# Altium project NODEMCU_ESP12.PrjPCB
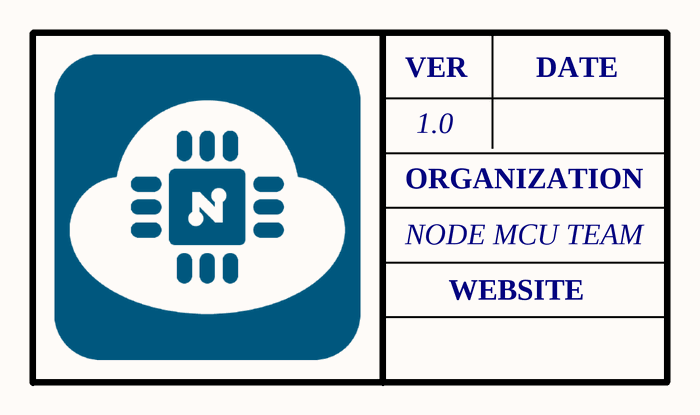
[diagram p0: 01_SYSTEM.SchDoc]
7 sheets, 34 parts. Net scope: flat (ports and power ports of the same name join across sheets).
Board file: NODEMCU_ESP12.PcbDoc
Sheets:
  01_SYSTEM.SchDoc
  02_ESP12_CORE.SchDoc
  03_USB_TO_UART.SchDoc
  04_POWER.SchDoc
  05_IO_CONN.SchDoc
  06_KEY.SchDoc
  07_ADC.SchDoc

## Sheet 01_SYSTEM.SchDoc: NODE MCU DEVKIT V1.0
size A4; Date: 25/01/2015; Author: HuangRui <vowstar@gmail.com>; DrawnBy: JiYaping <jyp1817@gmail.com>; Organization: WWW.NODEMCU.COM

### Notes on the sheet
- VER
- 1.0
- DATE
- ORGANIZATION
- NODE MCU TEAM
- WEBSITE

## Sheet 02_ESP12_CORE.SchDoc: ESP-12 CORE
size A4; Date: 20/11/2014; Author: HuangRui <vowstar@gmail.com>; DrawnBy: JiYaping <jyp1817@gmail.com>; Organization: WWW.NODEMCU.COM
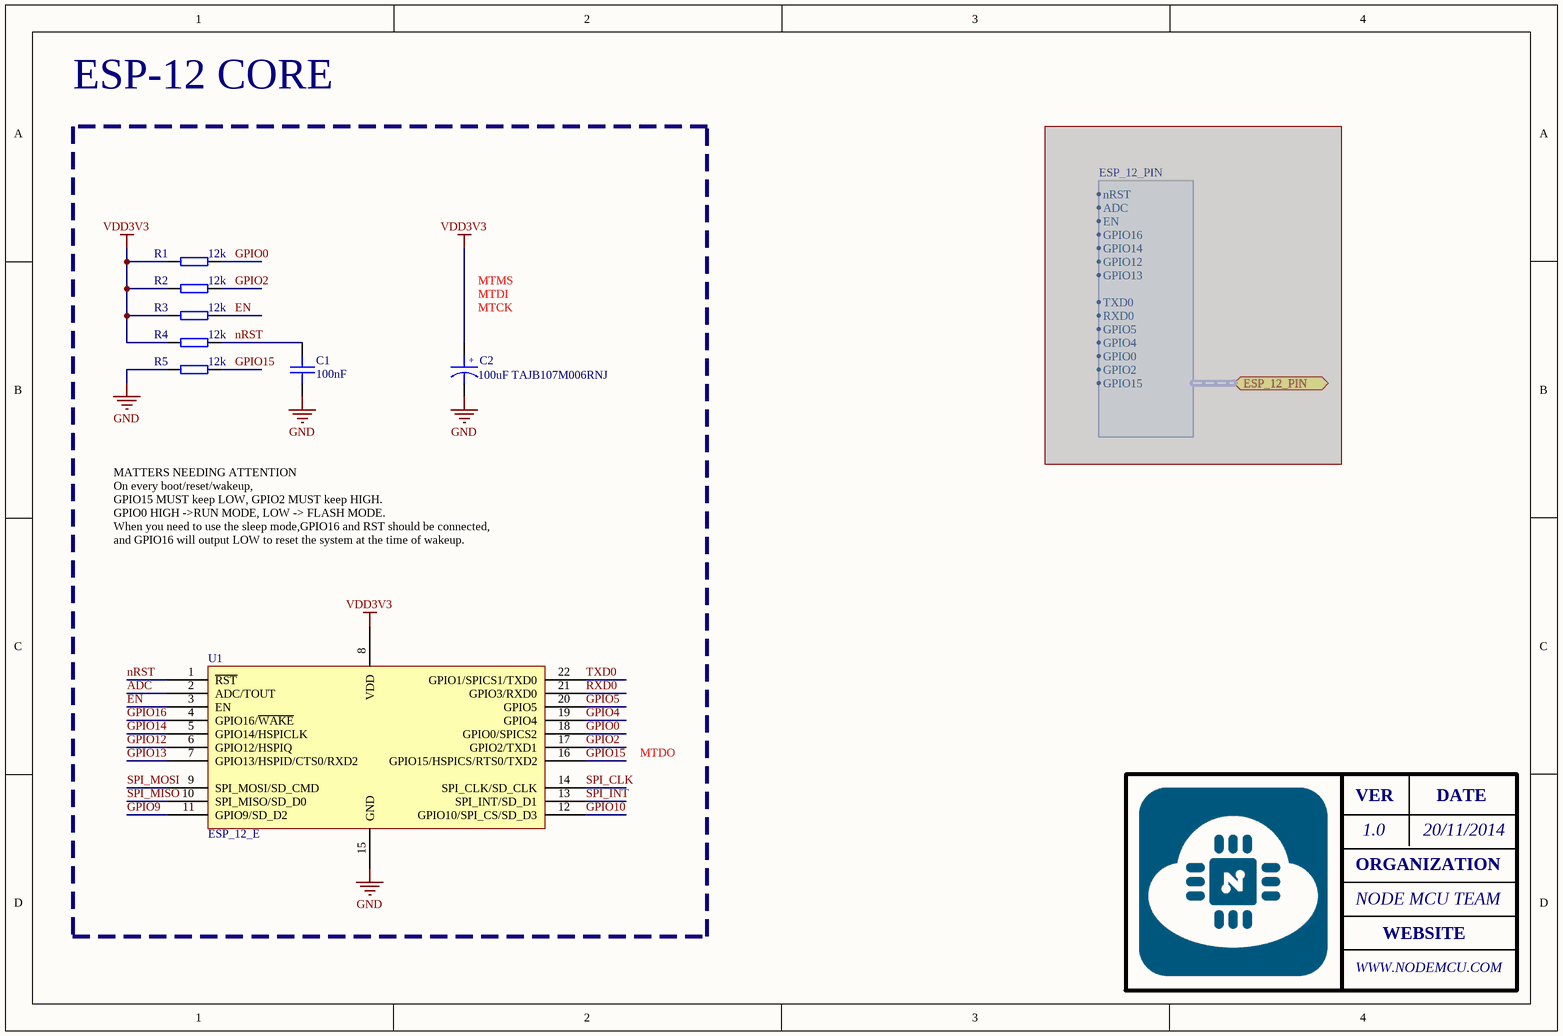
[diagram p1: 02_ESP12_CORE.SchDoc]

### Parts
C1  100nF  [SMT_C_0402]
C2  100uF TAJB107M006RNJ  [SMT_C_Tantalum_B]
R1  12k  [SMT_R_0402]
R2  12k  [SMT_R_0402]
R3  12k  [SMT_R_0402]
R4  12k  [SMT_R_0402]
R5  12k  [SMT_R_0402]
U1  ESP_12_E  [ESP_12_E_L]

### Ports
ESP_12_PIN (harness ESP_12_PIN)

### Harnesses
ESP_12_PIN: nRST, ADC, EN, GPIO16, GPIO12, GPIO13, GPIO14, TXD0, RXD0, GPIO4, GPIO5, GPIO0, GPIO2, GPIO15

### Nets
GND: C1.2 C2.2 R5.1 U1.15(GND)
VDD3V3: C2.1 R1.1 R2.1 R3.1 R4.1 U1.8(VDD)
ADC: U1.2(ADC/TOUT)
EN: R3.2 U1.3(EN)
GPIO0: R1.2 U1.18(GPIO0/SPICS2)
GPIO2: R2.2 U1.17(GPIO2/TXD1)
GPIO4: U1.19(GPIO4)
GPIO5: U1.20(GPIO5)
GPIO9: U1.11(GPIO9/SD_D2)
GPIO10: U1.12(GPIO10/SPI_CS/SD_D3)
GPIO12: U1.6(GPIO12/HSPIQ)
GPIO13: U1.7(GPIO13/HSPID/CTS0/RXD2)
GPIO14: U1.5(GPIO14/HSPICLK)
GPIO15: R5.2 U1.16(GPIO15/HSPICS/RTS0/TXD2)
GPIO16: U1.4(GPIO16/~{WAKE})
nRST: C1.1 R4.2 U1.1(~{RST})
RXD0: U1.21(GPIO3/RXD0)
SPI_CLK: U1.14(SPI_CLK/SD_CLK)
SPI_INT: U1.13(SPI_INT/SD_D1)
SPI_MISO: U1.10(SPI_MISO/SD_D0)
SPI_MOSI: U1.9(SPI_MOSI/SD_CMD)
TXD0: U1.22(GPIO1/SPICS1/TXD0)

### Notes on the sheet
- (near C2) MTCK
- MTDI
- MTMS
- MATTERS NEEDING ATTENTION
  On every boot/reset/wakeup,
  GPIO15 MUST keep LOW, GPIO2 MUST keep HIGH.
  GPIO0 HIGH ->RUN MODE, LOW -> FLASH MODE.
  When you need to use the sleep mode,GPIO16 and RST should be connected,
  and GPIO16 will output LOW to reset the system at the time of wakeup.
- MTDO
- VER
- 1.0
- DATE
- ORGANIZATION
- NODE MCU TEAM
- WEBSITE
- (in symbol SMT_C_Tantalum_B) +

### Library data of the parts
C1 = SMT_C_0402: Surface mount capacitor 0402
C2 = SMT_C_Tantalum_B: Capacitor, SM Tantalum; Body 3.5 x 2.8 mm (LxW typ)
R1-R5 = SMT_R_0402: Surface mount resistor 0402
U1 = ESP_12_E: ESP-12 Wi-Fi Module by AI-Thinker; IC: ESP8266-EX; Vendor: Ai-thinker

## Sheet 03_USB_TO_UART.SchDoc: USB TO UART
size A4; Date: 20/11/2014; Author: HuangRui <vowstar@gmail.com>; DrawnBy: JiYaping <jyp1817@gmail.com>; Organization: WWW.NODEMCU.COM
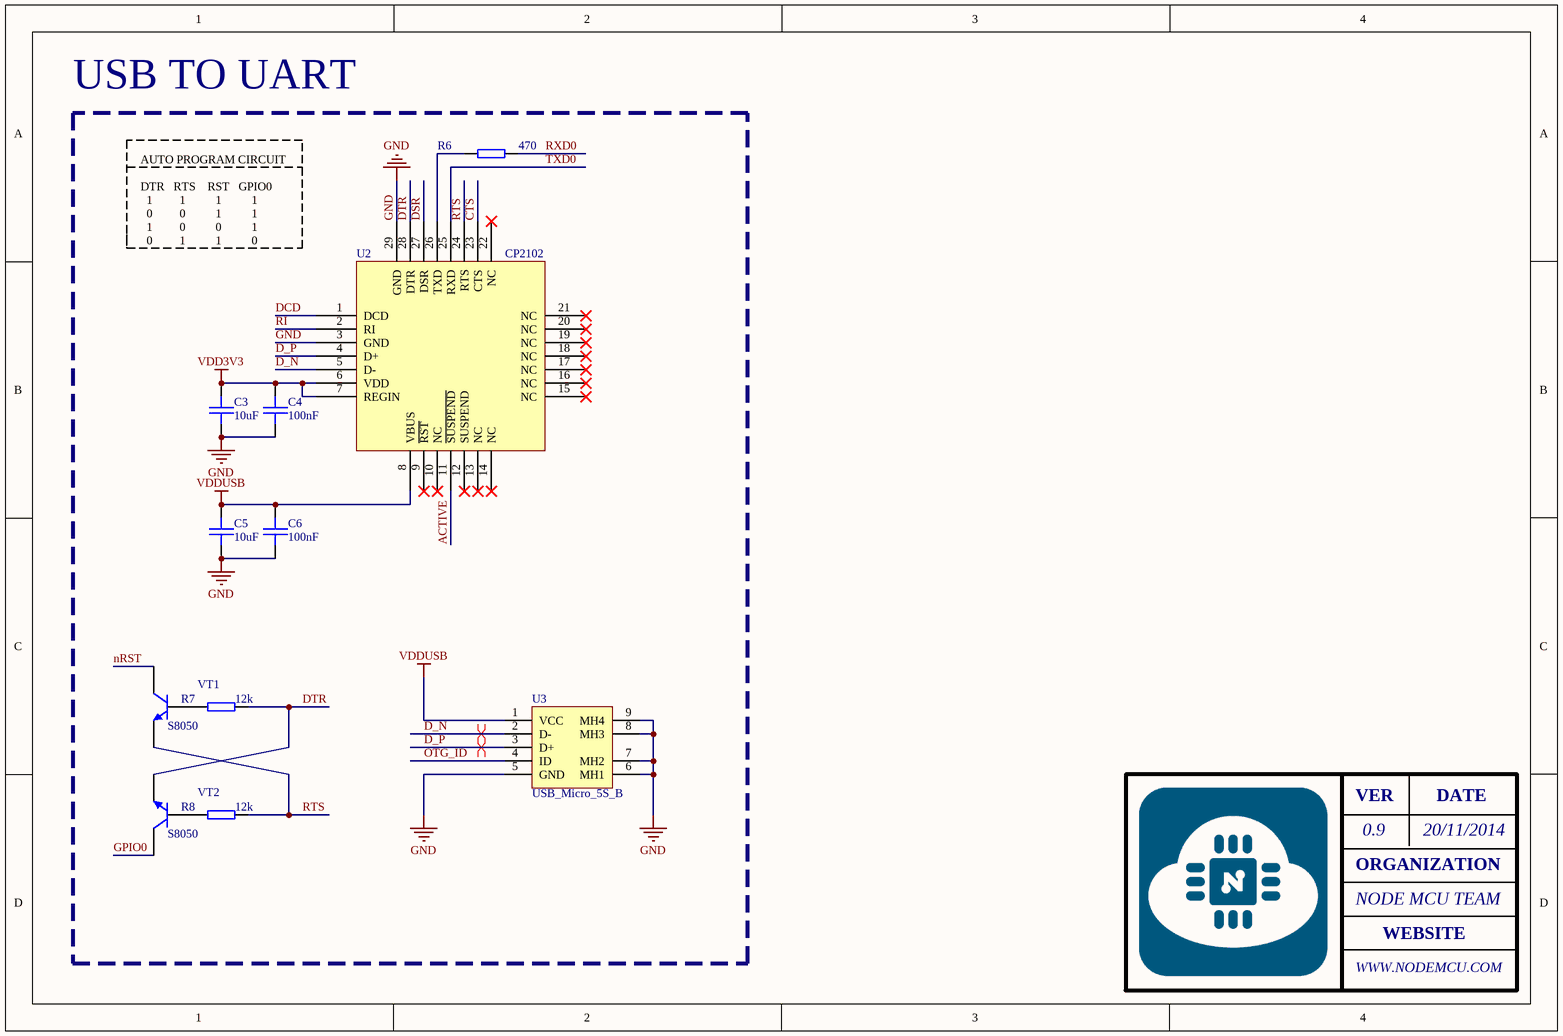
[diagram p2: 03_USB_TO_UART.SchDoc]

### Parts
C3  10uF  [SMT_C_0402]
C4  100nF  [SMT_C_0402]
C5  10uF  [SMT_C_0402]
C6  100nF  [SMT_C_0402]
R6  470  [SMT_R_0402]
R7  12k  [SMT_R_0402]
R8  12k  [SMT_R_0402]
U2  CP2102  [CP2102]
U3  USB_Micro_5S_B  [USB_MICRO_5S_B]
VT1  S8050  [SMT_TRIODE_NPN]
VT2  S8050  [SMT_TRIODE_NPN]

### Nets
GND: C3.2 C4.2 C5.2 C6.2 U2.3(GND) U2.29(GND) U3.5(GND) U3.6(MH1) U3.7(MH2) U3.8(MH3) U3.9(MH4)
VDD3V3: C3.1 C4.1 U2.6(VDD) U2.7(REGIN)
VDDUSB: C5.1 C6.1 U2.8(VBUS) U3.1(VCC)
ACTIVE: U2.11(~{SUSPEND})
CTS: U2.23(CTS)
D_N: U2.5(D-) U3.2(D-)
D_P: U2.4(D+) U3.3(D+)
DCD: U2.1(DCD)
DSR: U2.27(DSR)
DTR: R7.2 U2.28(DTR) VT2.2(E)
GPIO0: VT2.3(C)
nRST: VT1.3(C)
OTG_ID: U3.4(ID)
RI: U2.2(RI)
RTS: R8.2 U2.24(RTS) VT1.2(E)
RXD0: R6.2
TXD0: U2.25(RXD)
NetR6_1: R6.1 U2.26(TXD)
NetR7_1: R7.1 VT1.1(B)
NetR8_1: R8.1 VT2.1(B)

Not connected (* = marked no-connect by the designer): U2 9(~{RST})* 10(NC)* 12(SUSPEND)* 13(NC)* 14(NC)* 15(NC)* 16(NC)* 17(NC)* 18(NC)* 19(NC)* 20(NC)* 21(NC)* 22(NC)*

### Layout directives
differential pair: D_N, D_P

### Notes on the sheet
- AUTO PROGRAM CIRCUIT
  DTR   RTS    RST   GPIO0
  1         1          1          1
  0         0          1          1
  1         0          0          1
  0         1          1          0
- VER
- 0.9
- DATE
- ORGANIZATION
- NODE MCU TEAM
- WEBSITE

### Library data of the parts
C3-C6 = SMT_C_0402: Surface mount capacitor 0402
R6-R8 = SMT_R_0402: Surface mount resistor 0402
U3 = USB_Micro_5S_B: USB micro female SMT with 4 fixed foot
VT1 VT2 = SMT_TRIODE_NPN: Surface mount NPN transistor, package SOT-23

## Sheet 04_POWER.SchDoc: POWER
size A4; Date: 28/01/2015; Author: HuangRui <vowstar@gmail.com>; DrawnBy: JiYaping <jyp1817@gmail.com>; Organization: WWW.NODEMCU.COM
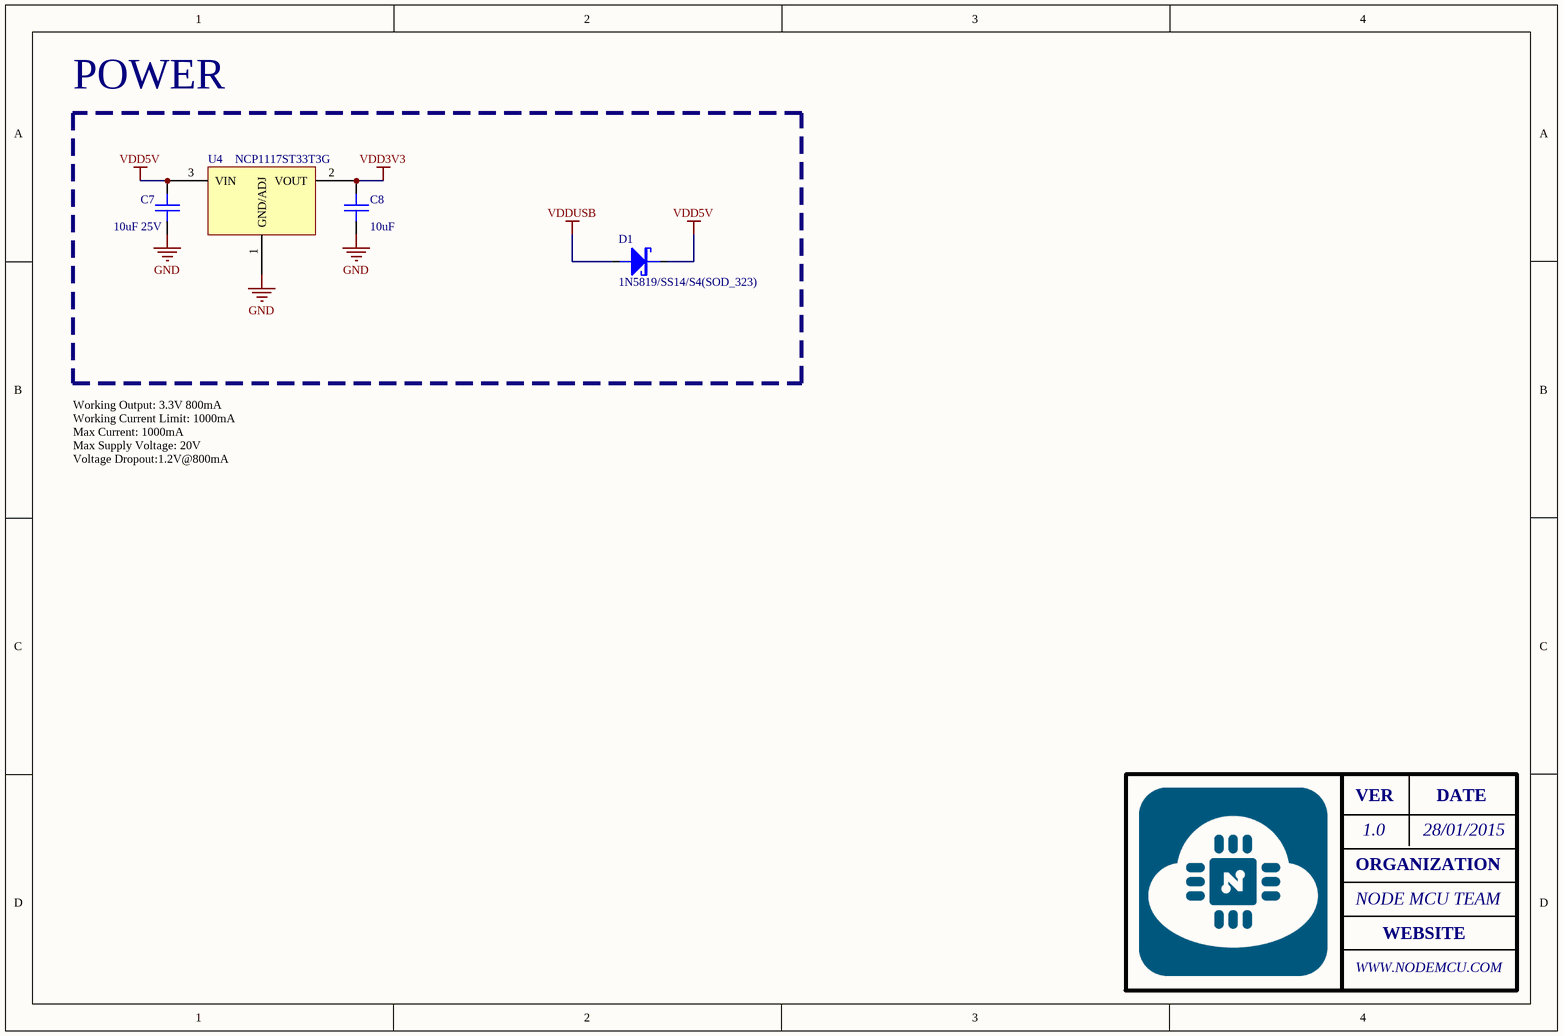
[diagram p3: 04_POWER.SchDoc]

### Parts
C7  10uF 25V  [SMT_C_0805]
C8  10uF  [SMT_C_0402]
D1  1N5819/SS14/S4(SOD_323)  [SMT_DIODE_SOD_323]
U4  NCP1117ST33T3G  [SOT-223]

### Nets
GND: C7.2 C8.2 U4.1(GND/ADJ)
VDD3V3: C8.1 U4.2(VOUT)
VDD5V: C7.1 D1.2(K) U4.3(VIN)
VDDUSB: D1.1(A)

### Notes on the sheet
- Working Output: 3.3V 800mA
  Working Current Limit: 1000mA
  Max Current: 1000mA
  Max Supply Voltage: 20V
  Voltage Dropout:1.2V@800mA
- VER
- 1.0
- DATE
- ORGANIZATION
- NODE MCU TEAM
- WEBSITE

### Library data of the parts
C7 = SMT_C_0805: Surface mount capacitor 0805
C8 = SMT_C_0402: Surface mount capacitor 0402
D1 = SMT_DIODE_SCHOTTKY_SOD_323: Surface mount schottky diode SOD-323(0805) Package
U4 = NCP1117: NCP1117, NCV1117. 1.0 A Low-Dropout Positive  Fixed and Adjustable  Voltage Regulators

## Sheet 05_IO_CONN.SchDoc: IO CONN
size A4; Date: 20/11/2014; Author: HuangRui <vowstar@gmail.com>; DrawnBy: JiYaping <jyp1817@gmail.com>; Organization: WWW.NODEMCU.COM
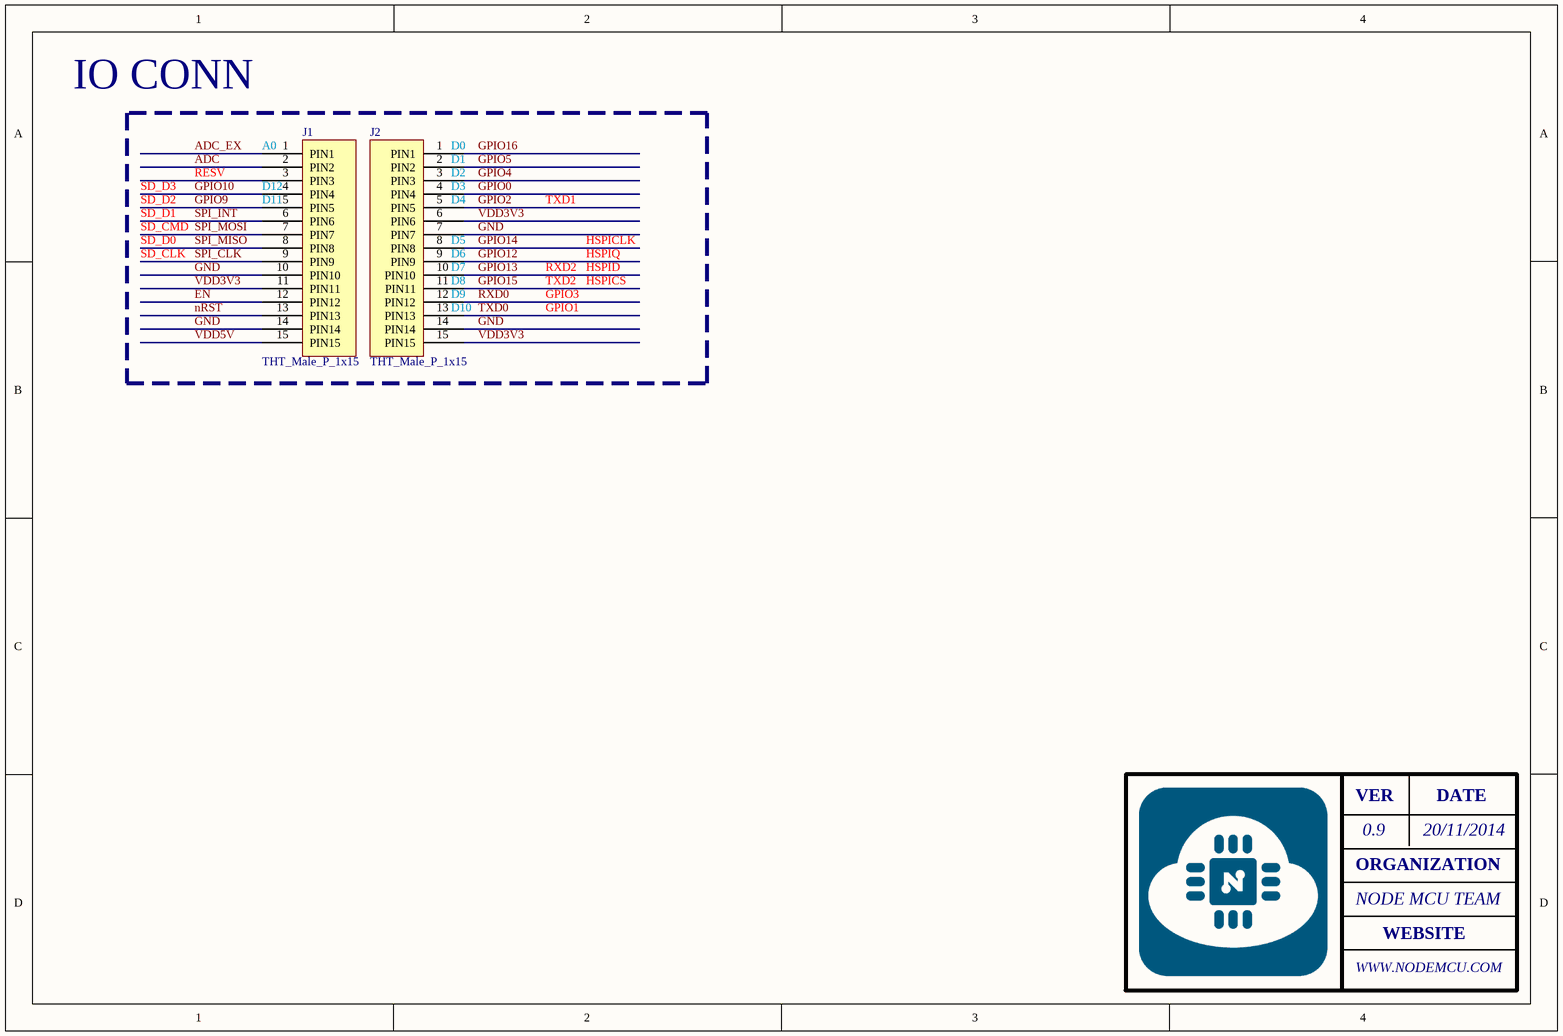
[diagram p4: 05_IO_CONN.SchDoc]

### Parts
J1  THT_Male_P_1x15  [THT_Male_P_1x15-2.54mm]
J2  THT_Male_P_1x15  [THT_Male_P_1x15-2.54mm]

### Nets
ADC: J1.2(PIN2)
ADC_EX: J1.1(PIN1)
EN: J1.12(PIN12)
GND: J1.10(PIN10) J1.14(PIN14) J2.7(PIN7) J2.14(PIN14)
GPIO0: J2.4(PIN4)
GPIO2: J2.5(PIN5)
GPIO4: J2.3(PIN3)
GPIO5: J2.2(PIN2)
GPIO9: J1.5(PIN5)
GPIO10: J1.4(PIN4)
GPIO12: J2.9(PIN9)
GPIO13: J2.10(PIN10)
GPIO14: J2.8(PIN8)
GPIO15: J2.11(PIN11)
GPIO16: J2.1(PIN1)
nRST: J1.13(PIN13)
RXD0: J2.12(PIN12)
SPI_CLK: J1.9(PIN9)
SPI_INT: J1.6(PIN6)
SPI_MISO: J1.8(PIN8)
SPI_MOSI: J1.7(PIN7)
TXD0: J2.13(PIN13)
VDD3V3: J1.11(PIN11) J2.6(PIN6) J2.15(PIN15)
VDD5V: J1.15(PIN15)

Not connected (* = marked no-connect by the designer): J1 3(PIN3)

### Notes on the sheet
- RESV
- (near J1) A0
- (near J2) D0
- (near J2) D1
- (near J2) D2
- SD_D0
- SD_CMD
- SD_D1
- SD_D3
- SD_D2
- (near J1) D12
- (near J1) D11
- (near J2) D3
- (near J2) D4
- (near J2) D5
- TXD1
- HSPICLK
- SD_CLK
- (near J2) D6
- (near J2) D7
- (near J2) D8
- (near J2) D9
- (near J2) D10
- TXD2
- RXD2
- GPIO3
- GPIO1
- HSPIQ
- HSPID
- HSPICS
- VER
- 0.9
- DATE
- ORGANIZATION
- NODE MCU TEAM
- WEBSITE

### Library data of the parts
J1 J2 = THT_Male_P_1x15: THT Male pin header strip 1x15

## Sheet 06_KEY.SchDoc: KEY
size A4; Date: 20/11/2014; Author: HuangRui <vowstar@gmail.com>; DrawnBy: JiYaping <jyp1817@gmail.com>; Organization: WWW.NODEMCU.COM
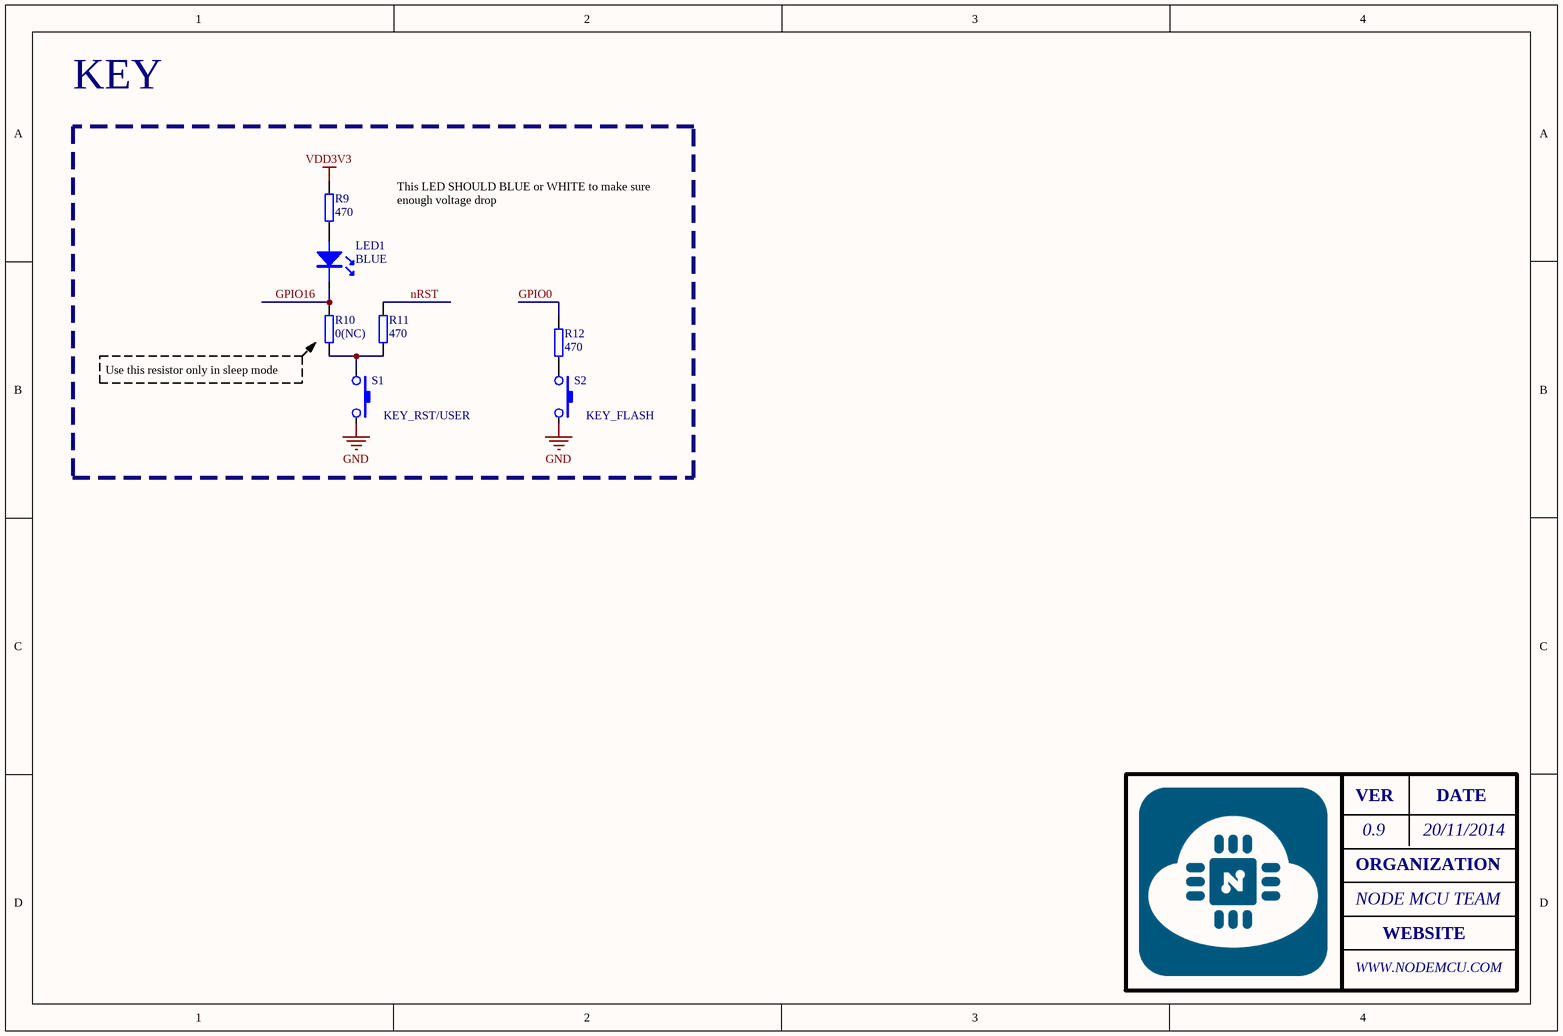
[diagram p5: 06_KEY.SchDoc]

### Parts
LED1  BLUE  [SMT_LED_0603]
R9  470  [SMT_R_0402]
R10  0(NC)  [SMT_R_0402]
R11  470  [SMT_R_0402]
R12  470  [SMT_R_0402]
S1  KEY_RST/USER  [SMT_SW_PTS_820]
S2  KEY_FLASH  [SMT_SW_PTS_820]

### Nets
GND: S1.2 S2.2
VDD3V3: R9.2
GPIO0: R12.2
GPIO16: LED1.2(K) R10.2
nRST: R11.2
NetLED1_1: LED1.1(A) R9.1
NetR10_1: R10.1 R11.1 S1.1
NetR12_1: R12.1 S2.1

### Notes on the sheet
- This LED SHOULD BLUE or WHITE to make sure enough voltage drop
- Use this resistor only in sleep mode
- VER
- 0.9
- DATE
- ORGANIZATION
- NODE MCU TEAM
- WEBSITE

### Library data of the parts
LED1 = SMT_LED_0603: SMT LED
R9-R12 = SMT_R_0402: Surface mount resistor 0402
S1 S2 = SMT_SW_PTS_820: SMT Tactile ‎Switch PTS 820 Series

## Sheet 07_ADC.SchDoc: ADC
size A4; Date: 20/11/2014; Author: HuangRui <vowstar@gmail.com>; DrawnBy: JiYaping <jyp1817@gmail.com>; Organization: WWW.NODEMCU.COM
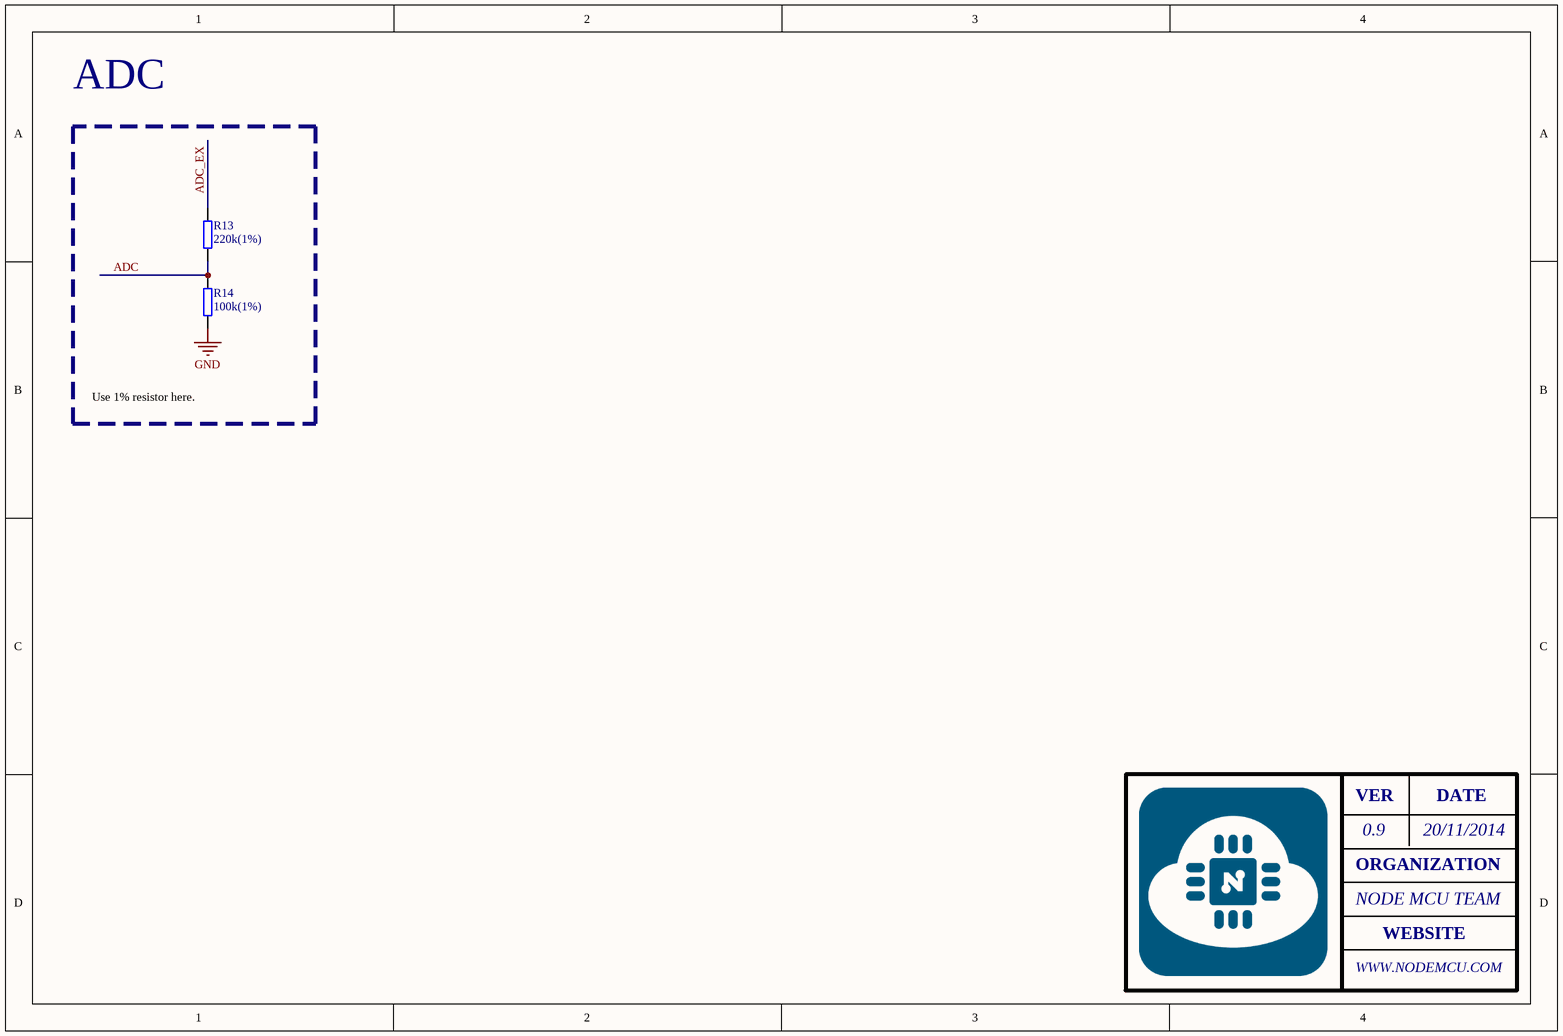
[diagram p6: 07_ADC.SchDoc]

### Parts
R13  220k(1%)  [SMT_R_0402]
R14  100k(1%)  [SMT_R_0402]

### Nets
GND: R14.1
ADC: R13.1 R14.2
ADC_EX: R13.2

### Notes on the sheet
- Use 1% resistor here.
- VER
- 0.9
- DATE
- ORGANIZATION
- NODE MCU TEAM
- WEBSITE

### Library data of the parts
R13 R14 = SMT_R_0402: Surface mount resistor 0402

## Nets that join several sheets
GND: 02_ESP12_CORE (C1.2 C2.2 R5.1 U1.15), 03_USB_TO_UART (11 pins), 04_POWER (C7.2 C8.2 U4.1), 06_KEY (S1.2 S2.2), 07_ADC (R14.1)
VDD3V3: 02_ESP12_CORE (6 pins), 03_USB_TO_UART (C3.1 C4.1 U2.6 U2.7), 04_POWER (C8.1 U4.2), 06_KEY (R9.2)
VDDUSB: 03_USB_TO_UART (C5.1 C6.1 U2.8 U3.1), 04_POWER (D1.1)